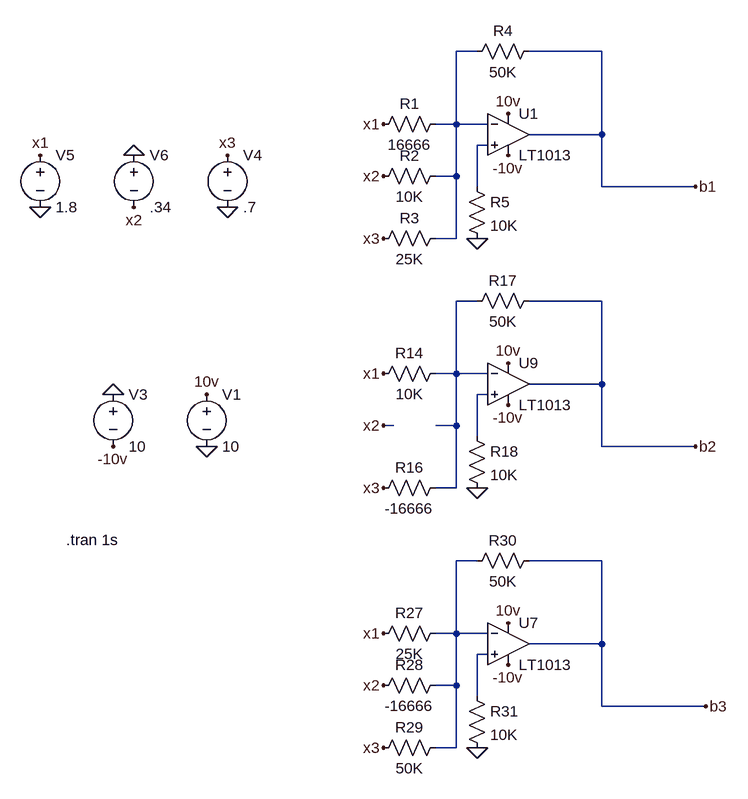
[diagram p0: schematic matrix_vector.asc]
matrix_vector.asc, the LTspice schematic file:
Version 4
SHEET 1 4384 2224
WIRE -512 464 -544 464
WIRE -320 464 -432 464
WIRE -544 576 -544 464
WIRE -544 576 -576 576
WIRE -496 576 -544 576
WIRE -320 592 -320 464
WIRE -320 592 -432 592
WIRE -496 608 -512 608
WIRE -544 656 -544 576
WIRE -544 656 -576 656
WIRE -512 672 -512 608
WIRE -320 672 -320 592
WIRE -176 672 -320 672
WIRE -544 752 -544 656
WIRE -544 752 -576 752
WIRE -512 848 -544 848
WIRE -320 848 -432 848
WIRE -544 960 -544 848
WIRE -544 960 -576 960
WIRE -496 960 -544 960
WIRE -320 976 -320 848
WIRE -320 976 -432 976
WIRE -496 992 -512 992
WIRE -640 1040 -656 1040
WIRE -544 1040 -544 960
WIRE -544 1040 -576 1040
WIRE -512 1056 -512 992
WIRE -320 1072 -320 976
WIRE -176 1072 -320 1072
WIRE -544 1136 -544 1040
WIRE -544 1136 -576 1136
WIRE -512 1248 -544 1248
WIRE -320 1248 -432 1248
WIRE -544 1360 -544 1248
WIRE -544 1360 -576 1360
WIRE -496 1360 -544 1360
WIRE -320 1376 -320 1248
WIRE -320 1376 -432 1376
WIRE -496 1392 -512 1392
WIRE -544 1440 -544 1360
WIRE -544 1440 -576 1440
WIRE -512 1456 -512 1392
WIRE -320 1472 -320 1376
WIRE -160 1472 -320 1472
WIRE -544 1536 -544 1440
WIRE -544 1536 -576 1536
FLAG -928 992 10v
FLAG -928 1072 0
FLAG -1072 992 0
FLAG -1072 1072 -10v
FLAG -464 560 10v
FLAG -512 752 0
FLAG -464 624 -10v
FLAG -656 656 x2
FLAG -656 752 x3
FLAG -176 672 b1
FLAG -464 944 10v
FLAG -512 1136 0
FLAG -464 1008 -10v
FLAG -656 1040 x2
FLAG -656 960 x1
FLAG -656 1136 x3
FLAG -176 1072 b2
FLAG -464 1344 10v
FLAG -512 1536 0
FLAG -464 1408 -10v
FLAG -656 1360 x1
FLAG -656 1440 x2
FLAG -656 1536 x3
FLAG -160 1472 b3
FLAG -656 576 x1
FLAG -896 624 x3
FLAG -896 704 0
FLAG -1184 624 x1
FLAG -1184 704 0
FLAG -1040 624 0
FLAG -1040 704 x2
SYMBOL voltage -928 976 R0
WINDOW 123 0 0 Left 0
SYMATTR InstName V1
SYMATTR Value 10
SYMATTR SpiceLine Rser=.8
SYMBOL voltage -1072 976 R0
WINDOW 123 0 0 Left 0
SYMATTR InstName V3
SYMATTR Value 10
SYMATTR SpiceLine Rser=.8
SYMBOL res -560 560 R90
WINDOW 0 0 56 VBottom 2
WINDOW 3 32 56 VTop 2
SYMATTR InstName R1
SYMATTR Value 16666
SYMBOL res -560 640 R90
WINDOW 0 0 56 VBottom 2
WINDOW 3 32 56 VTop 2
SYMATTR InstName R2
SYMATTR Value 10K
SYMBOL res -560 736 R90
WINDOW 0 0 56 VBottom 2
WINDOW 3 32 56 VTop 2
SYMATTR InstName R3
SYMATTR Value 25K
SYMBOL res -416 448 R90
WINDOW 0 0 56 VBottom 2
WINDOW 3 32 56 VTop 2
SYMATTR InstName R4
SYMATTR Value 50K
SYMBOL res -528 656 R0
SYMATTR InstName R5
SYMATTR Value 10K
SYMBOL res -560 944 R90
WINDOW 0 0 56 VBottom 2
WINDOW 3 32 56 VTop 2
SYMATTR InstName R14
SYMATTR Value 10K
SYMBOL res -560 1120 R90
WINDOW 0 0 56 VBottom 2
WINDOW 3 32 56 VTop 2
SYMATTR InstName R16
SYMATTR Value -16666
SYMBOL res -416 832 R90
WINDOW 0 0 56 VBottom 2
WINDOW 3 32 56 VTop 2
SYMATTR InstName R17
SYMATTR Value 50K
SYMBOL res -528 1040 R0
SYMATTR InstName R18
SYMATTR Value 10K
SYMBOL res -560 1344 R90
WINDOW 0 0 56 VBottom 2
WINDOW 3 32 56 VTop 2
SYMATTR InstName R27
SYMATTR Value 25K
SYMBOL res -560 1424 R90
WINDOW 0 0 56 VBottom 2
WINDOW 3 32 56 VTop 2
SYMATTR InstName R28
SYMATTR Value -16666
SYMBOL res -560 1520 R90
WINDOW 0 0 56 VBottom 2
WINDOW 3 32 56 VTop 2
SYMATTR InstName R29
SYMATTR Value 50K
SYMBOL res -416 1232 R90
WINDOW 0 0 56 VBottom 2
WINDOW 3 32 56 VTop 2
SYMATTR InstName R30
SYMATTR Value 50K
SYMBOL res -528 1440 R0
SYMATTR InstName R31
SYMATTR Value 10K
SYMBOL OpAmps\\LT1013 -464 528 R0
SYMATTR InstName U1
SYMBOL OpAmps\\LT1013 -464 1312 R0
SYMATTR InstName U7
SYMBOL OpAmps\\LT1013 -464 912 R0
SYMATTR InstName U9
SYMBOL voltage -896 608 R0
WINDOW 123 0 0 Left 0
SYMATTR InstName V4
SYMATTR Value .7
SYMATTR SpiceLine Rser=.8
SYMBOL voltage -1184 608 R0
WINDOW 123 0 0 Left 0
SYMATTR InstName V5
SYMATTR Value 1.8
SYMATTR SpiceLine Rser=.8
SYMBOL voltage -1040 608 R0
WINDOW 123 0 0 Left 0
SYMATTR InstName V6
SYMATTR Value .34
SYMATTR SpiceLine Rser=.8
TEXT -1144 1216 Left 2 !.tran 1s

The netlist it stands for:
* matrix_vector.asc
V1 10v 0 10 Rser=.8
V3 0 -10v 10 Rser=.8
R1 N001 x1 16666
R2 N001 x2 10K
R3 N001 x3 25K
R4 b1 N001 50K
R5 N002 0 10K
R14 N003 x1 10K
R16 N003 x3 -16666
R17 b2 N003 50K
R18 N004 0 10K
R27 N005 x1 25K
R28 N005 x2 -16666
R29 N005 x3 50K
R30 b3 N005 50K
R31 N006 0 10K
XU1 N002 N001 10v -10v b1 LT1013  ; pins In+ In- V+ V- OUT
XU7 N006 N005 10v -10v b3 LT1013  ; pins In+ In- V+ V- OUT
XU9 N004 N003 10v -10v b2 LT1013  ; pins In+ In- V+ V- OUT
V4 x3 0 .7 Rser=.8
V5 x1 0 1.8 Rser=.8
V6 0 x2 .34 Rser=.8
.tran 1s
.lib LTC.lib
.backanno
.end